# EAGLE schematic BeatLights (EAGLE 6.3)
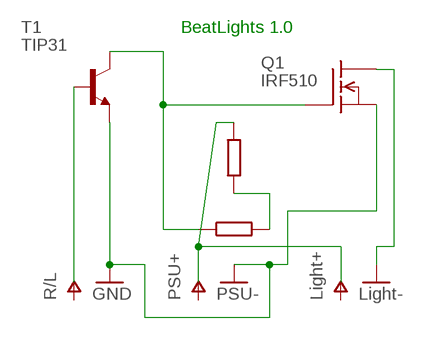
[diagram p0: schematic, sheet 1]

## Parts
Q1  IRF510  [TO220]
T1  TIP31  [TO220]

## Nets
GND: Q1.2(D) Q1.3(S) T1.3(E) ; supply symbol labelled Light-, PSU-
N$1: T1.1(B)
N$5: Q1.1(G) T1.2(C)

## Notes on the sheet
- BeatLights 1.0

## Library data of the parts
Q1 = transistor-fet:IRF510: N-Channel Enhancement MOSFET (HEXFET); 100V; 5,6A; 0,54Ohm
T1 = transistor:TIP31: NPN Transistor Medium Power Linear Switching Applications Source: http://onsemi.com